# EAGLE board DRM-X_voice(control) (EAGLE 7.4.0), part 1 of 2
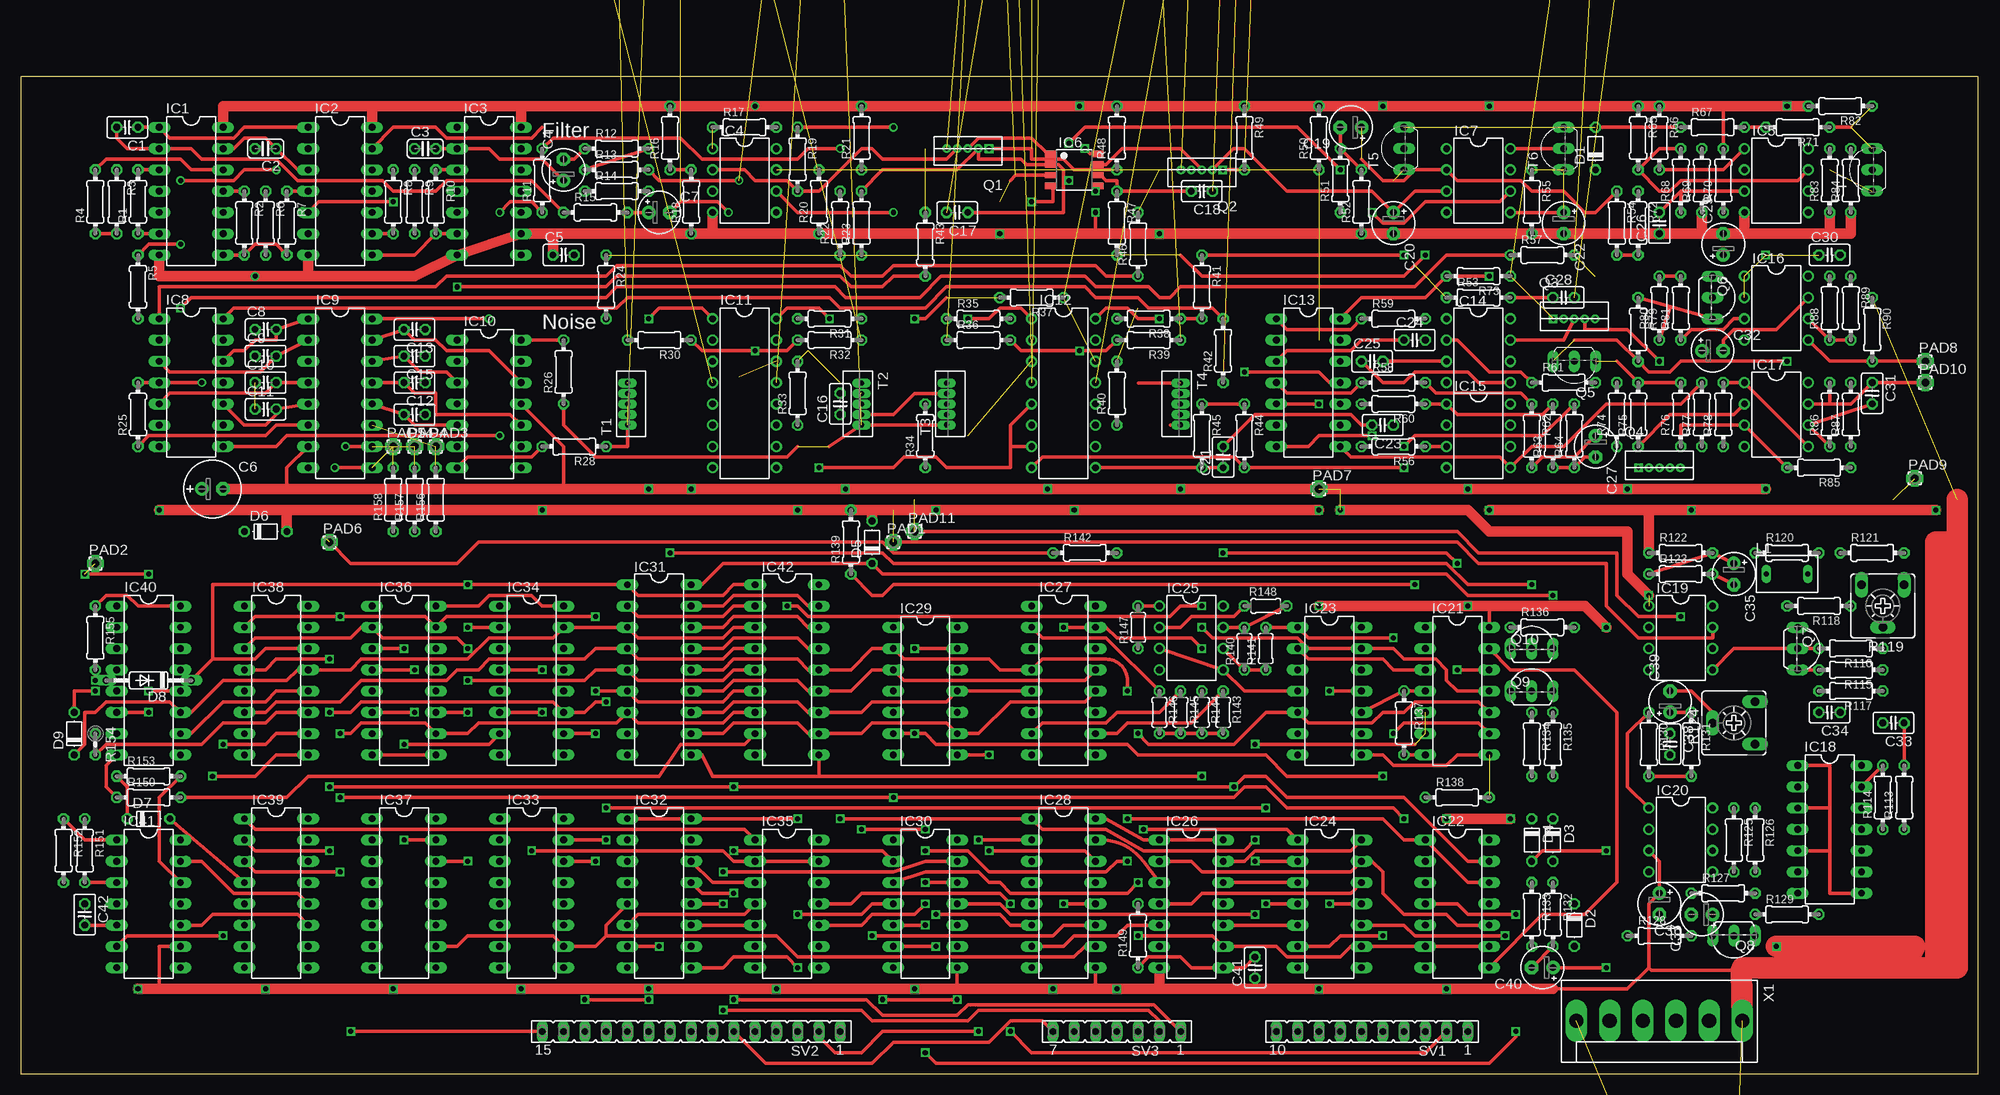
[diagram p5: board, top side]
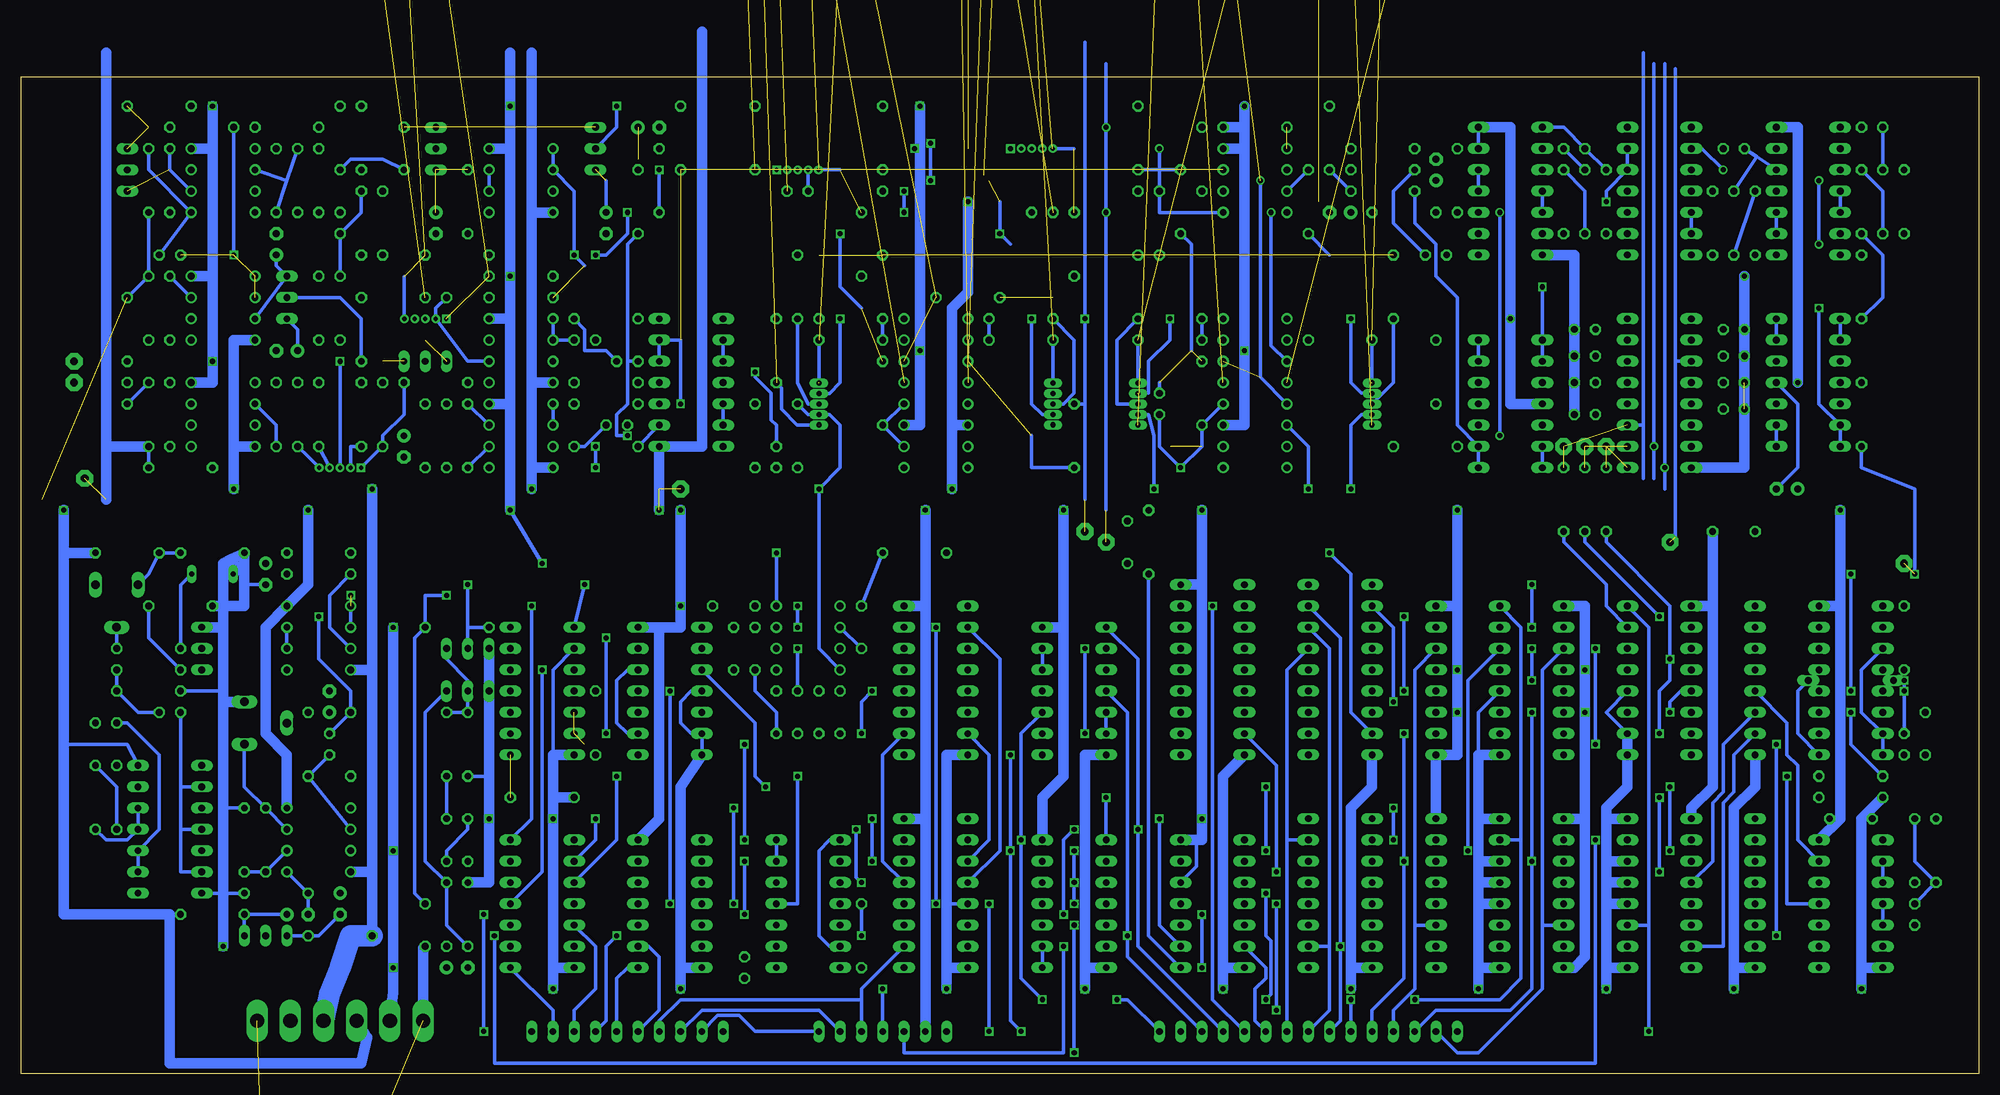
[diagram p6: board, bottom side, seen from below]

Size 233.66 x 119.05 mm. Coordinates in mm from the lower left corner, seen from the top.
Outline: 0,0 233.66,0 233.66,119.05 0,119.05 0,0
Copper layers (1*16): Top 0.035mm / dielectric 1.5mm / Bottom 0.035mm
Design rules "default": minimum track width 10mil, minimum drill 24mil, track to track 8mil, track to pad 8mil, pad to pad 8mil, via to via 8mil, smd to smd 8mil, copper to edge 40mil, drill to drill 8mil, minimum pad ring 10mil, minimum via ring 8mil, stop-mask expansion 4mil, vias tented up to drill 0mil, thermal gap 10mil
Net classes: 1 PWR: width 0.508 mm

## Footprints (pad centres in the part's own frame; a part is rotated, then mirrored left to right if it is on the bottom)
C025-025X050 = drill 0.813 octagon: 1 -1.27,0; 2 1.27,0
C025-024X044 = drill 0.813 octagon: 1 -1.27,0; 2 1.27,0
E2,5-5 = drill 0.813 pad 1.6: + -1.27,0 | drill 0.813 pad 1.6 octagon: - 1.27,0
E2,5-7 = drill 0.813 pad 1.6: + -1.27,0 | drill 0.813 pad 1.6 octagon: - 1.27,0
D-5 = drill 0.813 octagon: A 2.54,0; C -2.54,0
DO35-10 = drill 0.813 long: A 5.08,0; C -5.08,0
10MM_SM_COIN_CELL_CLIP = smd 2.9 x 3.5: +@1 -6.6,0; +@2 6.6,0 | smd 3.96 x 3.96: - 0,0
DIL14 = drill 0.813 long: 1 -7.62,-3.81; 2 -5.08,-3.81; 3 -2.54,-3.81; 4 0,-3.81; 5 2.54,-3.81; 6 5.08,-3.81; 7 7.62,-3.81; 8 7.62,3.81; 9 5.08,3.81; 10 2.54,3.81; 11 0,3.81; 12 -2.54,3.81; 13 -5.08,3.81; 14 -7.62,3.81
DIL08 = drill 0.813 pad 1.27: 1 -3.81,-3.81; 2 -1.27,-3.81; 3 1.27,-3.81; 4 3.81,-3.81; 5 3.81,3.81; 6 1.27,3.81; 7 -1.27,3.81; 8 -3.81,3.81
SOP8 = smd 0.76 x 1.27: 1 -1.905,-2.86; 2 -0.635,-2.86; 3 0.635,-2.86; 4 1.905,-2.86; 5 1.905,2.86; 6 0.635,2.86; 7 -0.635,2.86; 8 -1.905,2.86
DIL16 = drill 0.813 long: 1 -8.89,-3.81; 2 -6.35,-3.81; 3 -3.81,-3.81; 4 -1.27,-3.81; 5 1.27,-3.81; 6 3.81,-3.81; 7 6.35,-3.81; 8 8.89,-3.81; 9 8.89,3.81; 10 6.35,3.81; 11 3.81,3.81; 12 1.27,3.81; 13 -1.27,3.81; 14 -3.81,3.81; 15 -6.35,3.81; 16 -8.89,3.81
DIL16' = drill 0.813 pad 1.27: 1 -8.89,-3.81; 2 -6.35,-3.81; 3 -3.81,-3.81; 4 -1.27,-3.81; 5 1.27,-3.81; 6 3.81,-3.81; 7 6.35,-3.81; 8 8.89,-3.81; 9 8.89,3.81; 10 6.35,3.81; 11 3.81,3.81; 12 1.27,3.81; 13 -1.27,3.81; 14 -3.81,3.81; 15 -6.35,3.81; 16 -8.89,3.81
DIL18 = drill 0.813 long: 1 -10.16,-3.81; 2 -7.62,-3.81; 3 -5.08,-3.81; 4 -2.54,-3.81; 5 0,-3.81; 6 2.54,-3.81; 7 5.08,-3.81; 8 7.62,-3.81; 9 10.16,-3.81; 10 10.16,3.81; 11 7.62,3.81; 12 5.08,3.81; 13 2.54,3.81; 14 0,3.81; 15 -2.54,3.81; 16 -5.08,3.81; 17 -7.62,3.81; 18 -10.16,3.81
SD75 = drill 0.6 long: 1 -2.5,0; 2 2.5,0
2,0/0,9-O = drill 0.914 pad 2 octagon: 1 0,0
XSIST_SIP5 = drill 0.508 pad 0.034 square: 1 -2.5,0 | drill 0.508 pad 0.034: 2 -1.25,0; 3 0,0; 4 1.25,0; 5 2.5,0
TO92-ECB = drill 0.813 long: B 2.54,0; C 0,0; E -2.54,0
TO92-LINE = drill 0.813 long: 1 2.54,0; 2 0,0; 3 -2.54,0
0204/7 = drill 0.813 octagon: 1 -3.81,0; 2 3.81,0
CA6V = drill 1.016 long: A -2.54,-2.54; E 2.54,-2.54; S 0,2.54
0204/5 = drill 0.813 octagon: 1 -2.54,0; 2 2.54,0
0204V = drill 0.813 octagon: 1 -1.27,0; 2 1.27,0
FE10 = drill 0.813 long: 1 -11.43,0; 2 -8.89,0; 3 -6.35,0; 4 -3.81,0; 5 -1.27,0; 6 1.27,0; 7 3.81,0; 8 6.35,0; 9 8.89,0; 10 11.43,0
FE15 = drill 0.813 long: 1 -17.78,0; 2 -15.24,0; 3 -12.7,0; 4 -10.16,0; 5 -7.62,0; 6 -5.08,0; 7 -2.54,0; 8 0,0; 9 2.54,0; 10 5.08,0; 11 7.62,0; 12 10.16,0; 13 12.7,0; 14 15.24,0; 15 17.78,0
FE07 = drill 0.813 long: 1 -7.62,0; 2 -5.08,0; 3 -2.54,0; 4 0,0; 5 2.54,0; 6 5.08,0; 7 7.62,0
SIP-5 = drill 0.6 pad 0.7 long: 1 -2.5,0; 2 -1.25,0; 3 0,0; 4 1.25,0; 5 2.5,0
KK-156-6 = drill 1.7 pad 2.184 long: 1 -9.9,0; 2 -5.94,0; 3 -1.98,0; 4 1.98,0; 5 5.94,0; 6 9.9,0

## Placement (x,y rotation side)
C1  cer  [C025-025X050]  12.7,113.03 180 top
C2  myl  [C025-024X044]  29.21,110.49 180 top
C3  myl  [C025-024X044]  48.26,110.49 0 top
C4  [E2,5-5]  64.77,107.95 90 top
C5  cer  [C025-025X050]  64.77,97.79 0 top
C6  [E2,5-7]  22.86,69.85 0 top
C7  [E2,5-5]  76.2,102.87 0 top
C8  cer  [C025-025X050]  29.21,88.9 0 top
C9  cer  [C025-025X050]  29.21,85.72 0 top
C10  cer  [C025-025X050]  29.21,82.55 0 top
C11  cer  [C025-025X050]  29.21,79.38 0 top
C12  cer  [C025-025X050]  46.99,82.55 180 top
C13  cer  [C025-025X050]  46.99,88.9 180 top
C14  cer  [C025-025X050]  46.99,78.74 180 top
C15  cer  [C025-025X050]  46.99,85.72 180 top
C16  cer  [C025-025X050]  97.79,80.01 90 top
C17  cer  [C025-025X050]  111.76,102.87 180 top
C18  cer  [C025-025X050]  140.97,105.41 180 top
C19  [E2,5-5]  158.75,113.03 180 top
C20  [E2,5-5]  163.83,101.6 270 top
C21  cer  [C025-025X050]  143.51,73.66 90 top
C22  [E2,5-5]  184.15,101.6 270 top
C23  cer  [C025-025X050]  162.56,77.47 180 top
C24  cer  [C025-025X050]  166.37,87.63 0 top
C25  cer  [C025-025X050]  161.29,85.09 0 top
C26  cer  [C025-025X050]  195.58,101.6 90 top
C27  [E2,5-5]  187.96,74.93 270 top
C28  cer  [C025-025X050]  184.15,92.71 0 top
C29  [E2,5-5]  203.2,99.06 90 top
C30  cer  [C025-025X050]  215.9,97.79 0 top
C31  cer  [C025-025X050]  220.98,81.28 270 top
C32  [E2,5-5]  201.93,86.36 0 top
C33  cer  [C025-025X050]  223.52,41.91 180 top
C34  cer  [C025-025X050]  215.9,43.18 180 top
C35  [E2,5-5]  204.47,59.69 270 top
C36  [E2,5-5]  200.66,19.05 180 top
C37  [E2,5-5]  195.58,20.32 270 top
C38  cer  [C025-025X050]  196.85,39.37 270 top
C39  [E2,5-5]  196.85,44.45 90 top
C40  [E2,5-5]  181.61,12.7 180 top
C41  cer  [C025-025X050]  147.32,12.7 90 top
C42  470pF  [C025-025X050]  7.62,19.05 270 top
D1  [D-5]  187.96,110.49 90 top
D2  [D-5]  185.42,17.78 270 top
D3  [D-5]  182.88,27.94 270 top
D4  [D-5]  180.34,27.94 270 top
D5  [D-5]  101.6,63.5 90 top
D6  [D-5]  29.21,64.77 0 top
D7  [D-5]  15.24,30.48 0 top
D8  1N4148DO35-10  [DO35-10]  15.24,46.99 180 top
D9  [D-5]  6.35,40.64 90 top
G1  10MM_SM_COIN_CELL_CLIP  [10MM_SM_COIN_CELL_CLIP]  204.47,-22.86 0 top  (outside the outline)
IC1  4069N  [DIL14]  20.32,105.41 270 top
IC2  4016N  [DIL14]  38.1,105.41 270 top
IC3  4069N  [DIL14]  55.88,105.41 270 top
IC4  LM2903N  [DIL08]  86.36,106.68 270 top
IC5  LM2903N  [DIL08]  209.55,106.68 270 top
IC6  M5218AFP  [SOP8]  125.73,107.95 270 top
IC7  TL082P  [DIL08]  173.99,106.68 270 top
IC8  LM2902N  [DIL14]  20.32,82.55 270 top
IC9  4051N  [DIL16]  38.1,81.28 270 top
IC10  LM2902N  [DIL14]  55.88,80.01 270 top
IC11  LM13600N  [DIL16']  86.36,81.28 270 top
IC12  LM13600N  [DIL16']  124.46,81.28 270 top
IC13  4016N  [DIL14]  153.67,82.55 270 top
IC14  TL072P  [DIL08]  173.99,86.36 270 top
IC15  LM4558N  [DIL08]  173.99,76.2 270 top
IC16  LM4558N  [DIL08]  209.55,91.44 270 top
IC17  LM4558N  [DIL08]  209.55,78.74 270 top
IC18  4069N  [DIL14]  215.9,29.21 270 top
IC19  TL082P  [DIL08]  198.12,52.07 270 top
IC20  LM4558N  [DIL08]  198.12,27.94 270 top
IC21  4016N  [DIL14]  171.45,45.72 270 top
IC22  4081N  [DIL14]  171.45,20.32 270 top
IC23  4013N  [DIL14]  156.21,45.72 270 top
IC24  4081N  [DIL14]  156.21,20.32 270 top
IC25  TL082P  [DIL08]  139.7,52.07 270 top
IC26  4070N  [DIL14]  139.7,20.32 270 top
IC27  4175N  [DIL16]  124.46,46.99 270 top
IC28  4029N  [DIL16]  124.46,21.59 270 top
IC29  4016N  [DIL14]  107.95,45.72 270 top
IC30  4071N  [DIL14]  107.95,20.32 270 top
IC31  [DIL18]  76.2,48.26 270 top
IC32  4175N  [DIL16]  76.2,21.59 270 top
IC33  4029N  [DIL16]  60.96,21.59 270 top
IC34  4585N  [DIL16]  60.96,46.99 270 top
IC35  4073N  [DIL14]  91.44,20.32 270 top
IC36  4585N  [DIL16]  45.72,46.99 270 top
IC37  4029N  [DIL16]  45.72,21.59 270 top
IC38  4040N  [DIL16]  30.48,46.99 270 top
IC39  4028N  [DIL16]  30.48,21.59 270 top
IC40  4051N  [DIL16]  15.24,46.99 270 top
IC41  4069N  [DIL14]  15.24,20.32 270 top
IC42  [DIL18]  91.44,48.26 270 top
L1  [SD75]  210.82,59.69 0 top
PAD1  [2,0/0,9-O]  104.14,63.5 0 top
PAD2  [2,0/0,9-O]  8.89,60.96 0 top
PAD3  [2,0/0,9-O]  49.53,74.93 0 top
PAD4  [2,0/0,9-O]  46.99,74.93 0 top
PAD5  [2,0/0,9-O]  44.45,74.93 0 top
PAD6  [2,0/0,9-O]  36.83,63.5 0 top
PAD7  [2,0/0,9-O]  154.94,69.85 0 top
PAD8  [2,0/0,9-O]  227.33,85.09 0 top
PAD9  [2,0/0,9-O]  226.06,71.12 0 top
PAD10  [2,0/0,9-O]  227.33,82.55 0 top
PAD11  Noise  [2,0/0,9-O]  106.68,64.77 0 top
Q1  2SC1583  [XSIST_SIP5]  113.03,110.49 180 top
Q2  2SC1583  [XSIST_SIP5]  140.97,107.95 180 top
Q3  2SC1583  [XSIST_SIP5]  185.42,90.17 0 top
Q4  2SC1583  [XSIST_SIP5]  195.58,72.39 0 top
Q5  D1111  [TO92-ECB]  185.42,85.09 180 top
Q6  2SC1815  [TO92-LINE]  201.93,92.71 270 top
Q7  2SC1815  [TO92-LINE]  212.09,50.8 270 top
Q8  2SC1815  [TO92-LINE]  204.47,16.51 180 top
Q9  2SC1815  [TO92-LINE]  180.34,45.72 0 top
Q10  2SC1815  [TO92-LINE]  180.34,50.8 0 top
R1  [0204/7]  13.97,104.14 90 top
R2  [0204/7]  26.67,101.6 270 top
R3  [0204/7]  11.43,104.14 270 top
R4  [0204/7]  8.89,104.14 90 top
R5  [0204/7]  13.97,93.98 270 top
R6  [0204/7]  29.21,101.6 270 top
R7  [0204/7]  31.75,101.6 270 top
R8  [0204/7]  44.45,104.14 270 top
R9  [0204/7]  46.99,104.14 270 top
R10  [0204/7]  49.53,104.14 270 top
R11  [0204/7]  62.23,106.68 90 top
R12  [0204/7]  71.12,110.49 0 top
R13  [0204/7]  71.12,107.95 0 top
R14  [0204/7]  71.12,105.41 0 top
R15  [0204/7]  68.58,102.87 0 top
R16  [0204/7]  77.47,111.76 90 top
R17  [0204/7]  86.36,113.03 0 top
R18  [0204/7]  80.01,104.14 90 top
R19  [0204/7]  92.71,109.22 270 top
R20  [0204/7]  95.25,104.14 90 top
R21  [0204/7]  100.33,111.76 90 top
R22  [0204/7]  97.79,101.6 90 top
R23  [0204/7]  100.33,101.6 90 top
R24  [0204/7]  69.85,93.98 270 top
R25  [0204/7]  13.97,78.74 90 top
R26  [0204/7]  64.77,83.82 90 top
R27  1K (SIP)  [0204/7]  67.31,146.05 270 bottom  (outside the outline)
R28  [0204/7]  66.04,74.93 180 top
R29  1K (SIP)  [0204/7]  71.12,146.05 270 bottom  (outside the outline)
R30  [0204/7]  76.2,87.63 180 top
R31  [0204/7]  96.52,90.17 180 top
R32  [0204/7]  96.52,87.63 180 top
R33  [0204/7]  92.71,81.28 90 top
R34  [0204/7]  107.95,76.2 90 top
R35  [0204/7]  114.3,90.17 0 top
R36  [0204/7]  114.3,87.63 0 top
R37  [0204/7]  120.65,92.71 180 top
R38  [0204/7]  134.62,90.17 180 top
R39  [0204/7]  134.62,87.63 180 top
R40  [0204/7]  130.81,81.28 90 top
R41  [0204/7]  140.97,93.98 270 top
R42  [0204/7]  143.51,86.36 90 top
R43  [0204/7]  107.95,99.06 270 top
R44  [0204/7]  146.05,76.2 270 top
R45  [0204/7]  140.97,76.2 270 top
R46  [0204/7]  133.35,99.06 90 top
R47  [0204/7]  130.81,101.6 270 top
R48  [0204/7]  130.81,111.76 90 top
R49  [0204/7]  146.05,111.76 270 top
R50  [0204/7]  154.94,111.76 90 top
R51  [0204/7]  157.48,106.68 90 top
R52  [0204/7]  160.02,104.14 90 top
R53  [0204/7]  173.99,92.71 0 top
R54  [0204/7]  190.5,101.6 270 top
R55  [0204/7]  180.34,104.14 270 top
R56  [0204/7]  163.83,74.93 180 top
R57  [0204/7]  181.61,97.79 0 top
R58  [0204/7]  163.83,82.55 0 top
R59  [0204/7]  163.83,90.17 0 top
R60  [0204/7]  163.83,80.01 180 top
R61  [0204/7]  184.15,82.55 0 top
R62  [0204/7]  180.34,76.2 270 top
R63  [0204/7]  182.88,76.2 90 top
R64  [0204/7]  185.42,76.2 90 top
R65  [0204/7]  193.04,111.76 270 top
R66  [0204/7]  195.58,111.76 270 top
R67  [0204/7]  201.93,113.03 0 top
R68  [0204/7]  198.12,106.68 90 top
R69  [0204/7]  200.66,106.68 90 top
R70  [0204/7]  203.2,106.68 90 top
R71  [0204/7]  212.09,113.03 180 top
R72  [0204/7]  193.04,101.6 270 top
R73  [0204/7]  173.99,95.25 180 top
R74  [0204/7]  190.5,78.74 90 top
R75  1%  [0204/7]  193.04,78.74 90 top
R76  1%  [0204/7]  198.12,78.74 90 top
R77  [0204/7]  200.66,78.74 90 top
R78  1%  [0204/7]  203.2,78.74 90 top
R79  [0204/7]  193.04,88.9 270 top
R80  [0204/7]  195.58,91.44 90 top
R81  [0204/7]  198.12,91.44 90 top
R82  [0204/7]  217.17,115.57 180 top
R83  [0204/7]  215.9,106.68 90 top
R84  [0204/7]  218.44,106.68 90 top
R85  1%  [0204/7]  214.63,72.39 180 top
R86  [0204/7]  215.9,78.74 90 top
R87  [0204/7]  218.44,78.74 90 top
R88  [0204/7]  215.9,91.44 90 top
R89  [0204/7]  218.44,91.44 270 top
R90  [0204/7]  220.98,88.9 270 top
R91  1K (SIP)  [0204/7]  184.15,143.51 270 bottom  (outside the outline)
R92  1K (SIP)  [0204/7]  113.03,144.78 270 bottom  (outside the outline)
R93  1K (SIP)  [0204/7]  116.84,144.78 270 bottom  (outside the outline)
R94  1K (SIP)  [0204/7]  120.65,144.78 270 bottom  (outside the outline)
R95  1K (SIP)  [0204/7]  134.62,165.1 270 bottom  (outside the outline)
R96  1K (SIP)  [0204/7]  187.96,143.51 270 bottom  (outside the outline)
R97  1K (SIP)  [0204/7]  139.7,143.51 270 bottom  (outside the outline)
R98  1K (SIP)  [0204/7]  143.51,143.51 270 bottom  (outside the outline)
R99  1K (SIP)  [0204/7]  147.32,143.51 270 bottom  (outside the outline)
R100  1K (SIP)  [0204/7]  191.77,143.51 270 bottom  (outside the outline)
R101  1K (SIP)  [0204/7]  138.43,165.1 270 bottom  (outside the outline)
R102  1K (SIP)  [0204/7]  142.24,165.1 270 bottom  (outside the outline)
R103  1K (SIP)  [0204/7]  146.05,165.1 270 bottom  (outside the outline)
R104  1K (SIP)  [0204/7]  74.93,146.05 270 bottom  (outside the outline)
R105  1K (SIP)  [0204/7]  86.36,146.05 270 bottom  (outside the outline)
R106  1K (SIP)  [0204/7]  90.17,146.05 270 bottom  (outside the outline)
R107  1K (SIP)  [0204/7]  93.98,146.05 270 bottom  (outside the outline)
R108  1K (SIP)  [0204/7]  97.79,146.05 270 bottom  (outside the outline)
R109  1K (SIP)  [0204/7]  114.3,161.29 270 bottom  (outside the outline)
R110  1K (SIP)  [0204/7]  118.11,161.29 270 bottom  (outside the outline)
R111  1K (SIP)  [0204/7]  121.92,161.29 270 bottom  (outside the outline)
R112  1K (SIP)  [0204/7]  78.74,146.05 270 bottom  (outside the outline)
R113  [0204/7]  224.79,33.02 90 top
R114  [0204/7]  222.25,33.02 90 top
R115  [0204/7]  218.44,48.26 180 top
R116  [0204/7]  218.44,50.8 180 top
R117  [0204/7]  218.44,45.72 180 top
R118  [0204/7]  214.63,55.88 180 top
R119  [CA6V]  222.25,55.88 180 top
R120  [0204/7]  210.82,62.23 0 top
R121  [0204/7]  220.98,62.23 0 top
R122  [0204/7]  198.12,62.23 0 top
R123  [0204/7]  198.12,59.69 0 top
R124  [CA6V]  204.47,41.91 90 top
R125  [0204/7]  204.47,27.94 270 top
R126  [0204/7]  207.01,27.94 270 top
R127  [0204/7]  203.2,21.59 0 top
R128  [0204/7]  195.58,16.51 0 top
R129  [0204/7]  210.82,19.05 0 top
R130  [0204/7]  194.31,39.37 270 top
R131  [0204/7]  199.39,39.37 270 top
R132  [0204/7]  182.88,19.05 270 top
R133  [0204/7]  180.34,19.05 270 top
R134  [0204/7]  180.34,39.37 270 top
R135  [0204/7]  182.88,39.37 270 top
R136  [0204/7]  181.61,53.34 0 top
R137  [0204/7]  165.1,41.91 270 top
R138  [0204/7]  171.45,33.02 0 top
R139  [0204/7]  99.06,63.5 90 top
R140  40K? 1%  [0204/5]  146.05,50.8 90 top
R141  80K? 1%  [0204/5]  148.59,50.8 90 top
R142  [0204/7]  127,62.23 0 top
R143  200K? 1%  [0204/5]  143.51,43.18 270 top
R144  400K? 1%  [0204/5]  140.97,43.18 270 top
R145  100K? 1%  [0204/5]  138.43,43.18 270 top
R146  50K? 1%  [0204/5]  135.89,43.18 270 top
R147  10K 1%  [0204/5]  133.35,53.34 90 top
R148  10K 1%  [0204/5]  148.59,55.88 0 top
R149  [0204/7]  133.35,16.51 90 top
R150  [0204/7]  15.24,33.02 0 top
R151  10k  [0204/7]  7.62,26.67 270 top
R152  10k  [0204/7]  5.08,26.67 270 top
R153  [0204/7]  15.24,35.56 0 top
R154  [0204V]  8.89,39.37 270 top
R155  [0204/7]  8.89,52.07 270 top
R156  [0204/7]  49.53,68.58 90 top
R157  [0204/7]  46.99,68.58 90 top
R158  [0204/7]  44.45,68.58 90 top
SV1  Key In  [FE10]  161.29,5.08 180 top
SV2  DISPLAY  [FE15]  80.01,5.08 180 top
SV3  EXT  [FE07]  130.81,5.08 180 top
T1  2SA798  [SIP-5]  72.39,80.01 90 top
T2  2SA798  [SIP-5]  100.33,80.01 270 top
T3  2SA798  [SIP-5]  110.49,80.01 90 top
T4  2SA798  [SIP-5]  138.43,80.01 270 top
T5  D1111  [TO92-ECB]  165.1,110.49 90 top
T6  D1111  [TO92-ECB]  184.15,110.49 90 top
T7  D1111  [TO92-ECB]  220.98,107.95 90 top
X1  [KK-156-6]  195.58,6.35 180 top